# EasyEDA schematic SCH_Balansir-280-V2_2023-08-31.json
TITLE: Sheet_1; REV: 1.0; Date: 2023-07-20; Sheet: 1/1; Drawn By: sanka_t; Company: Your Company
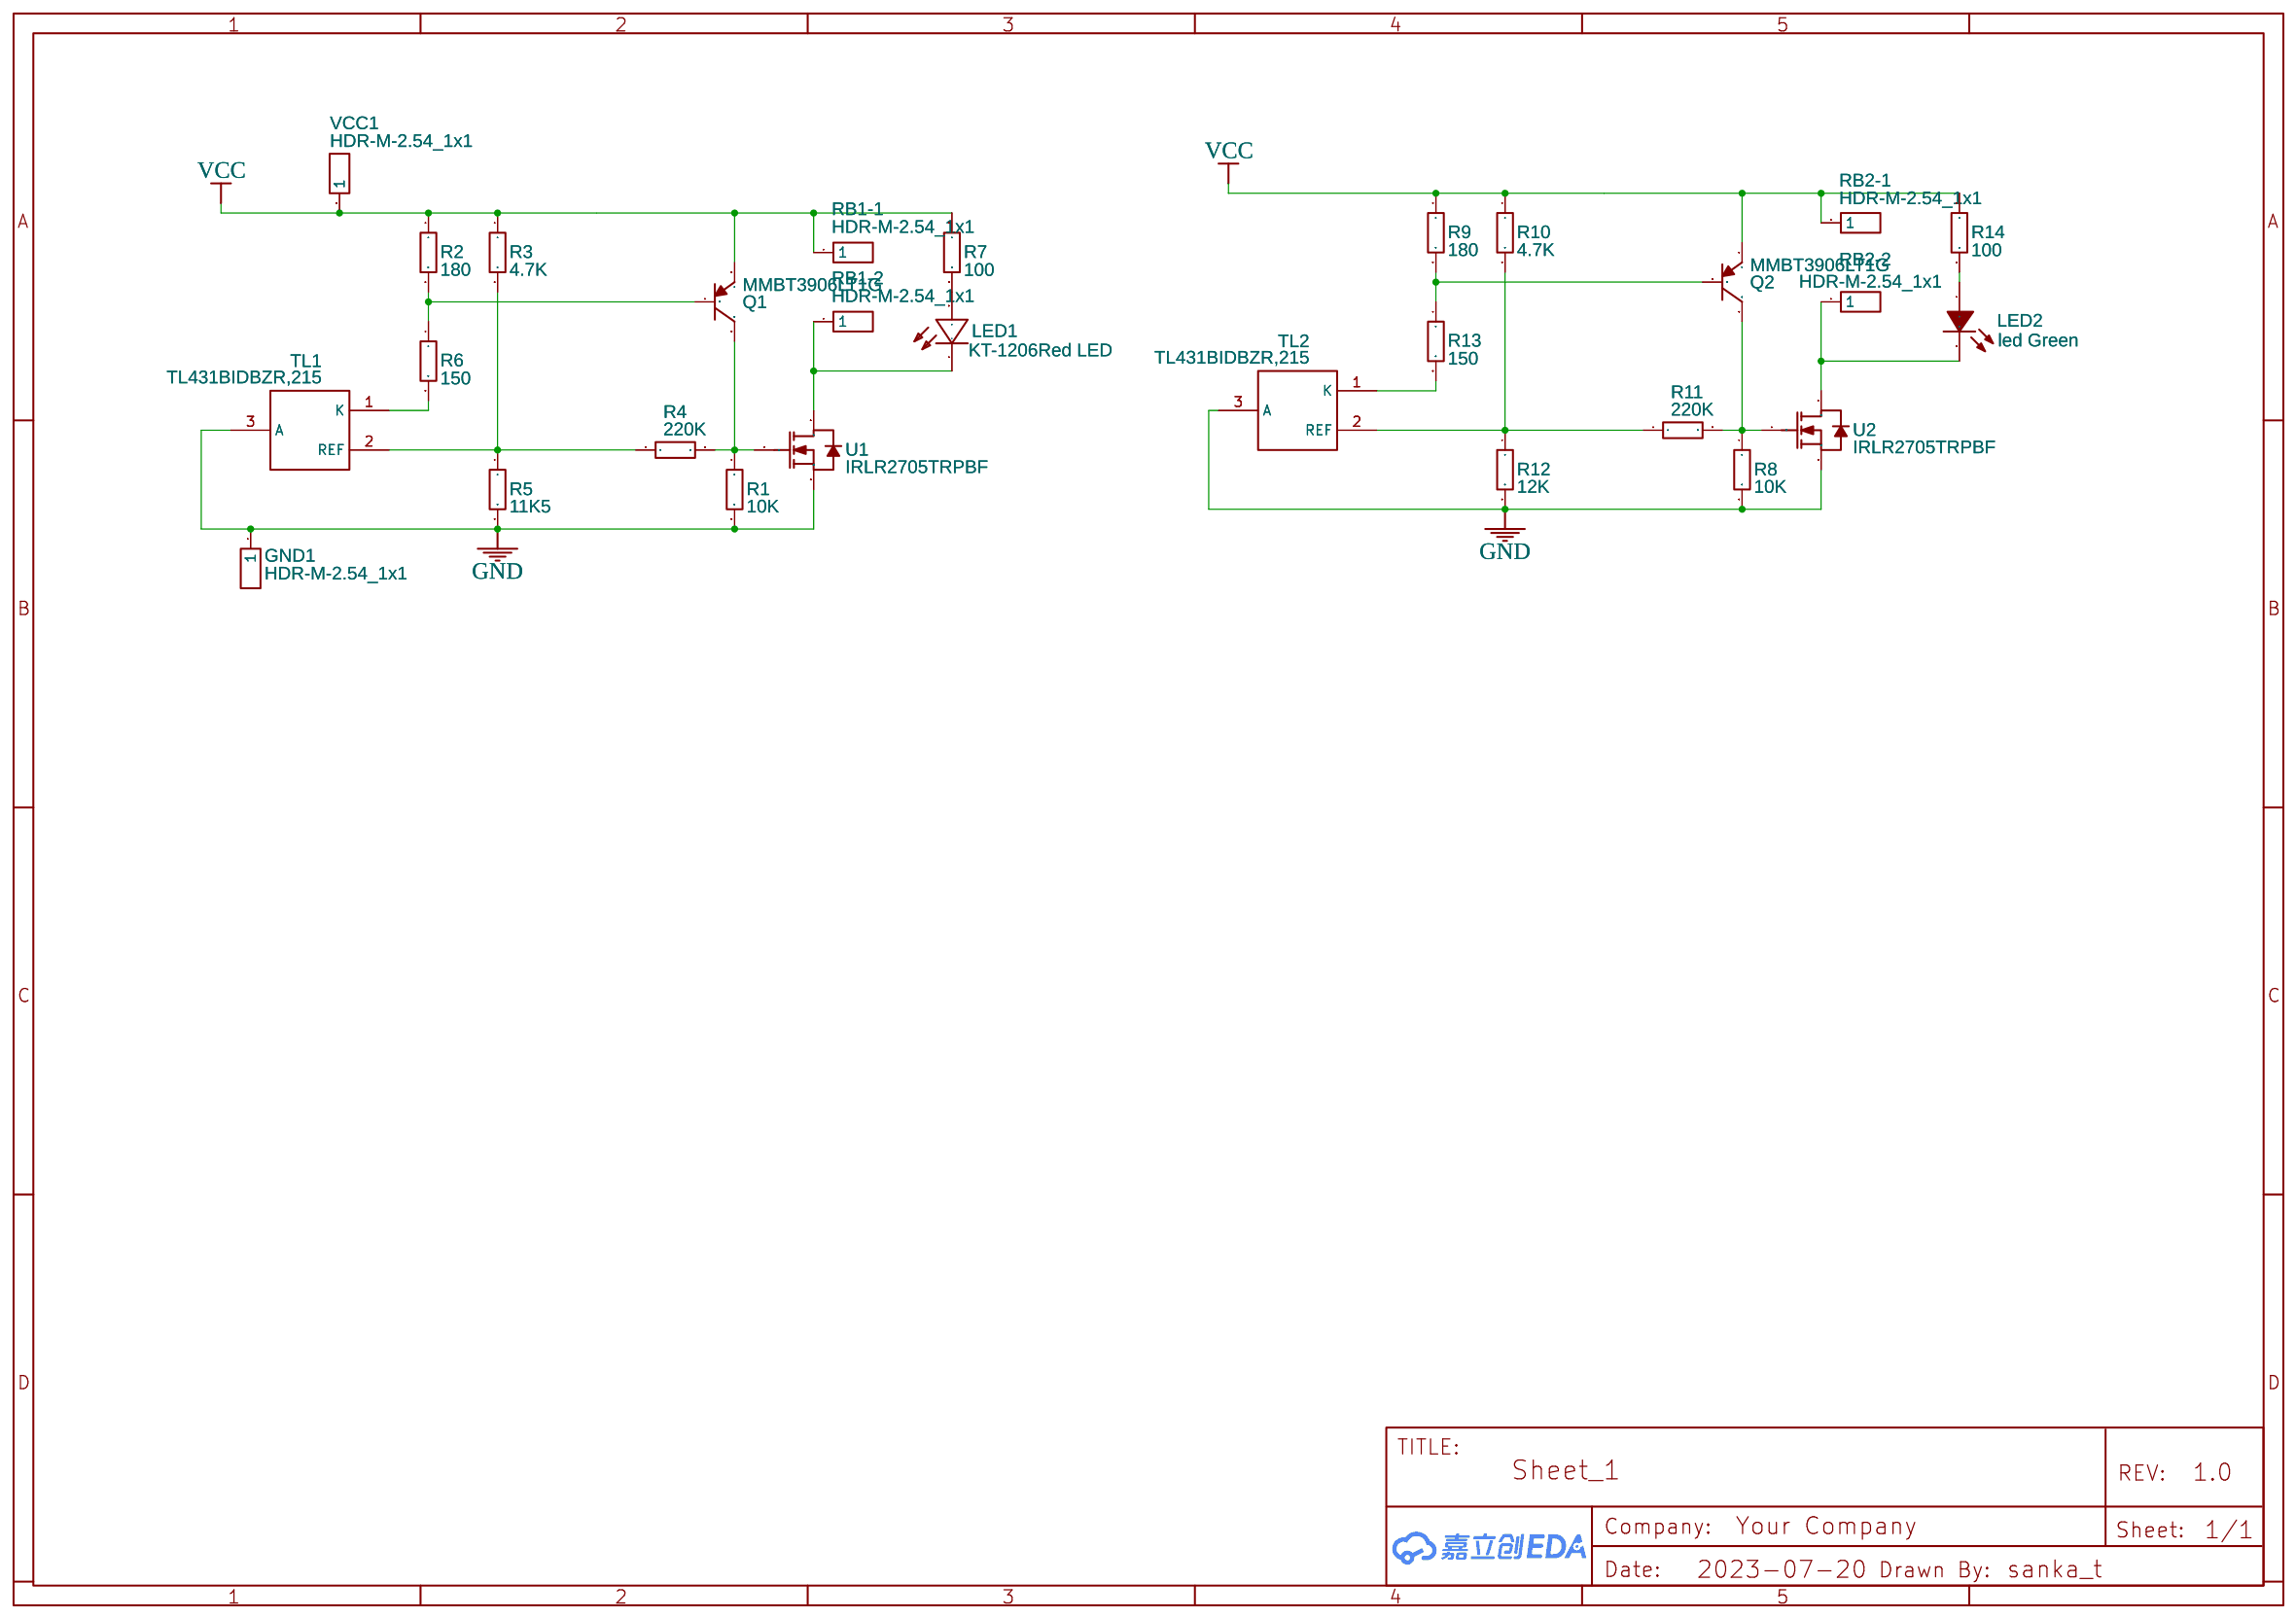
[diagram p0: schematic sheet]

## Parts
GND1  HDR-M-2.54_1x1  [HDR-M-2.54_1X1]
LED1  led Green  [LED1206-RD]
LED2  KT-1206Red LED  [LED1206-R-RD]
Q1  MMBT3906LT1G  [SOT-23-3_L2.9-W1.3-P1.90-LS2.4-BR]
Q2  MMBT3906LT1G  [SOT-23-3_L2.9-W1.3-P1.90-LS2.4-BR]
R1  10K  [R1206]
R2  180  [R1206]
R3  4.7K  [R1206]
R4  220K  [R1206]
R5  11K5  [R1206]
R6  150  [R1206]
R7  100  [R1206]
R8  10K  [R1206]
R9  180  [R1206]
R10  4.7K  [R1206]
R11  220K  [R1206]
R12  12K  [R1206]
R13  150  [R1206]
R14  100  [R1206]
RB1-1  HDR-M-2.54_1x1  [HDR-M-2.54_1X1]
RB1-2  HDR-M-2.54_1x1  [HDR-M-2.54_1X1]
RB2-1  HDR-M-2.54_1x1  [HDR-M-2.54_1X1]
RB2-2  HDR-M-2.54_1x1  [HDR-M-2.54_1X1]
TL1  TL431BIDBZR,215  [SOT-23-3_L2.9-W1.6-P1.90-LS2.8-BR]
TL2  TL431BIDBZR,215  [SOT-23-3_L2.9-W1.6-P1.90-LS2.8-BR]
U1  IRLR2705TRPBF  [DPAK-3_L6.6-W6.1-P2.28-LS9.9-BR]
U2  IRLR2705TRPBF  [DPAK-3_L6.6-W6.1-P2.28-LS9.9-BR]
VCC1  HDR-M-2.54_1x1  [HDR-M-2.54_1X1]

## Library data of the parts
GND1 RB1-1 RB1-2 RB2-1 RB2-2 VCC1 = HDR-M-2.54_1x1: Supplier Part: C81276; Supplier: LCSC; Contributor: LCEDA_Lib
LED1 = led Green: Supplier: LCSC; Manufacturer: KENTO; image: //image.lceda.cn/szlcsc/C14641.jpg; Supplier Part: C14641; SMT Type: Extend; JLCPCB SMD: Yes
LED2 = KT-1206Red LED: Supplier: LCSC; Manufacturer: KENTO; Supplier Part: C49018; JLCPCB Part Class: Extended Part
Q1 Q2 = MMBT3906LT1G: Supplier: LCSC; Manufacturer: ON; image: //image.lceda.cn/szlcsc/C53444.jpg; Supplier Part: C53444; SMT Type: Extend; JLCPCB SMD: Yes; LCSC Assembly: Yes
R1 R8 = RC1206JR-0710KL: Supplier: LCSC; Manufacturer: YAGEO; Supplier Part: C136460
R2 R9 = RC1206JR-07180RL: Supplier: LCSC; Manufacturer: YAGEO; Supplier Part: C137193
R3 R10 = RC1206JR-074K7L: Supplier: LCSC; Manufacturer: YAGEO; Supplier Part: C136458
R4 R11 = RC1206JR-07220KL: Supplier: LCSC; Manufacturer: YAGEO; Supplier Part: C137177
R5 R12 = RC1206JR-0711KL: Supplier: LCSC; Supplier Part: C246061; Manufacturer: YAGEO; Contributor: LCSC
R6 R13 = RC1206JR-07150RL: Supplier: LCSC; Manufacturer: YAGEO; Supplier Part: C137200
R7 R14 = RC1206JR-07100RL: Supplier: LCSC; Manufacturer: YAGEO; Contributor: LCSC; Supplier Part: C113307
TL1 TL2 = TL431BIDBZR,215: Supplier: LCSC; Manufacturer: Nexperia; Supplier Part: C78609; JLCPCB Part Class: Extended Part
U1 U2 = IRLR2705TRPBF: Supplier: LCSC; Supplier Part: C538165; Manufacturer: Infineon Technologies; Contributor: LCSC; SMT Type: Extend; JLCPCB SMD: Yes; LCSC Assembly: Yes

## Nets
GND: GND1.1 R1.2 R5.2 R8.2 R12.2 TL1.3(A) TL2.3(A) U1.3(S) U2.3(S)
VCC: Q1.2(E) Q2.2(E) R2.1 R3.1 R7.1 R9.1 R10.1 R14.1 RB1-1.1 RB2-1.1 VCC1.1
Net-(LED1-1): LED1.1(-) RB1-2.1 U1.2(D)
Net-(LED1-2): LED1.2(+) R7.2
Net-(LED2-1): LED2.1(A) R14.2
Net-(LED2-2): LED2.2(K) RB2-2.1 U2.2(D)
Net-(Q1-1): Q1.1(B) R2.2 R6.1
Net-(Q1-3): Q1.3(C) R1.1 R4.2 U1.1(G)
Net-(Q2-1): Q2.1(B) R9.2 R13.1
Net-(Q2-3): Q2.3(C) R8.1 R11.2 U2.1(G)
Net-(R3-2): R3.2 R4.1 R5.1 TL1.2(REF)
Net-(R6-2): R6.2 TL1.1(K)
Net-(R10-2): R10.2 R11.1 R12.1 TL2.2(REF)
Net-(R13-2): R13.2 TL2.1(K)
